# Altium schematic sheet SCH.SchDoc
size A1
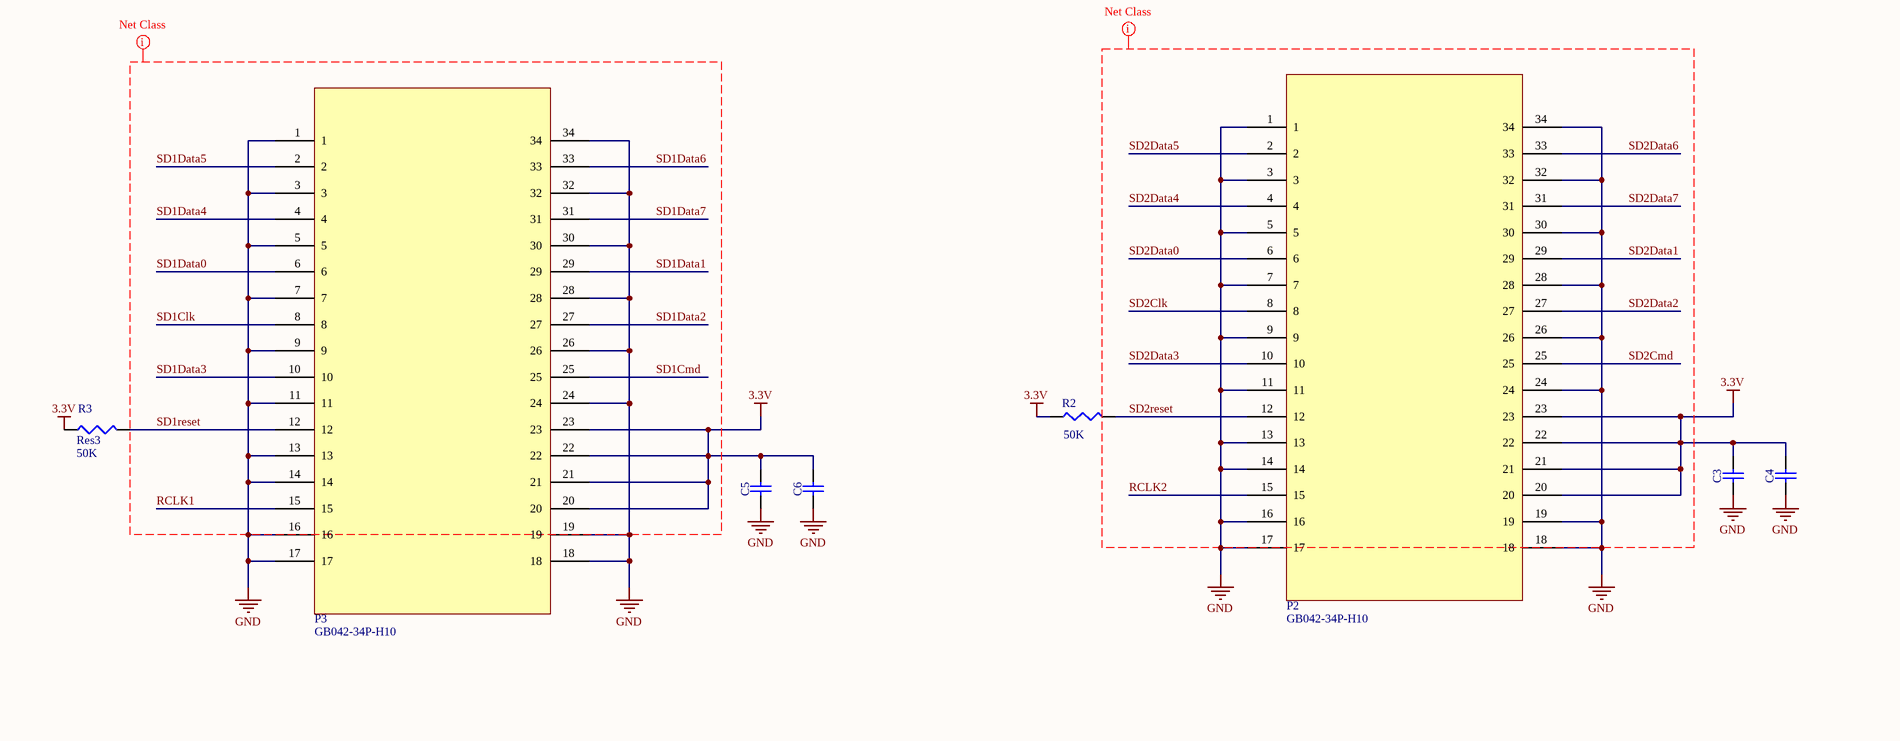
[diagram p0: SCH.SchDoc, top left]
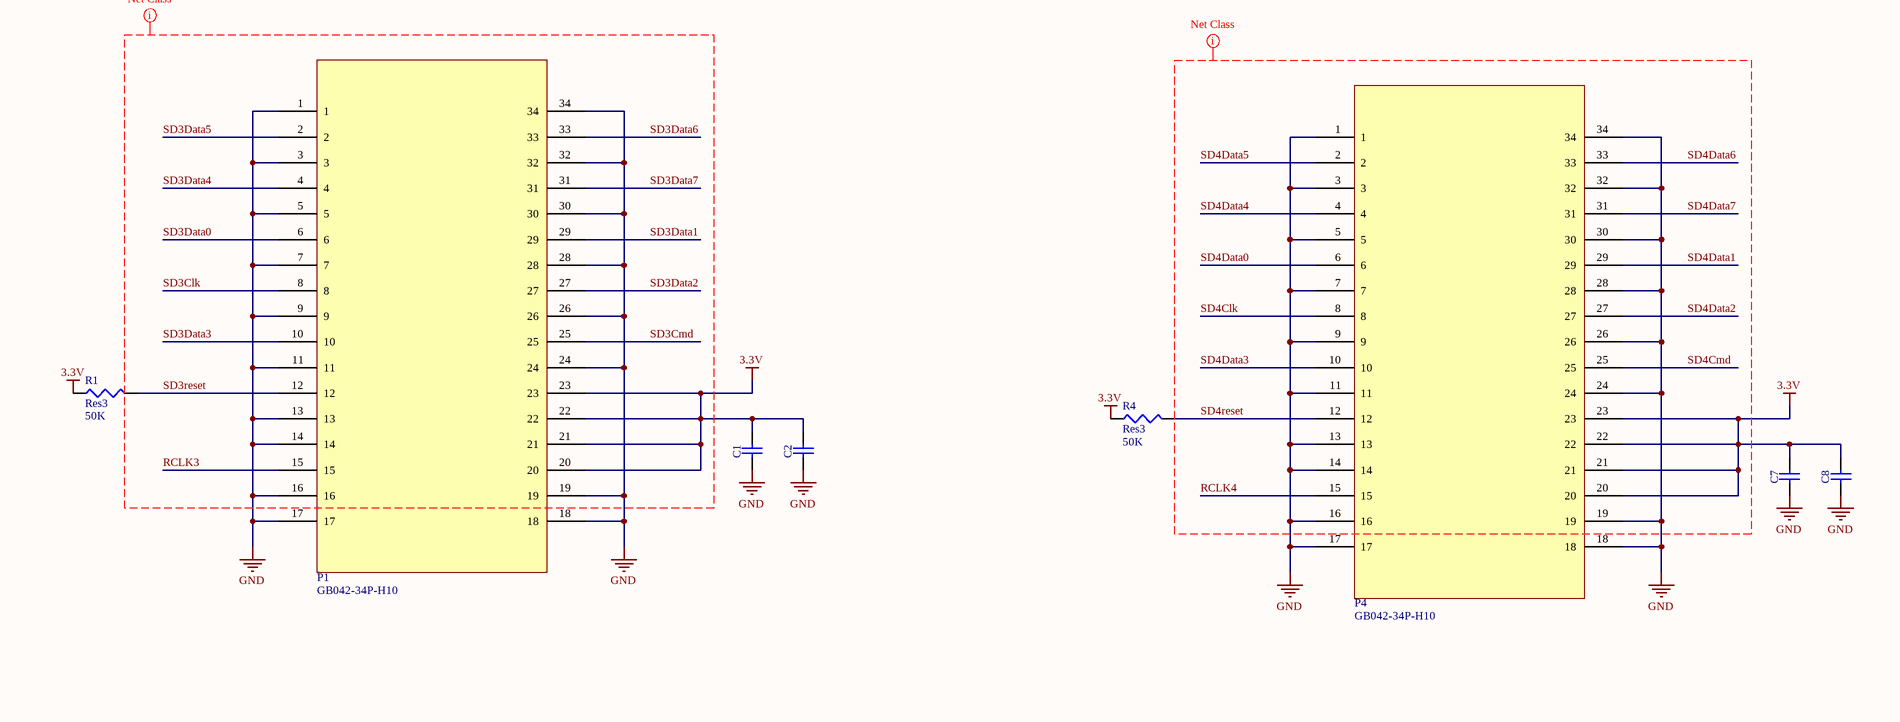
[diagram p1: SCH.SchDoc, top right]
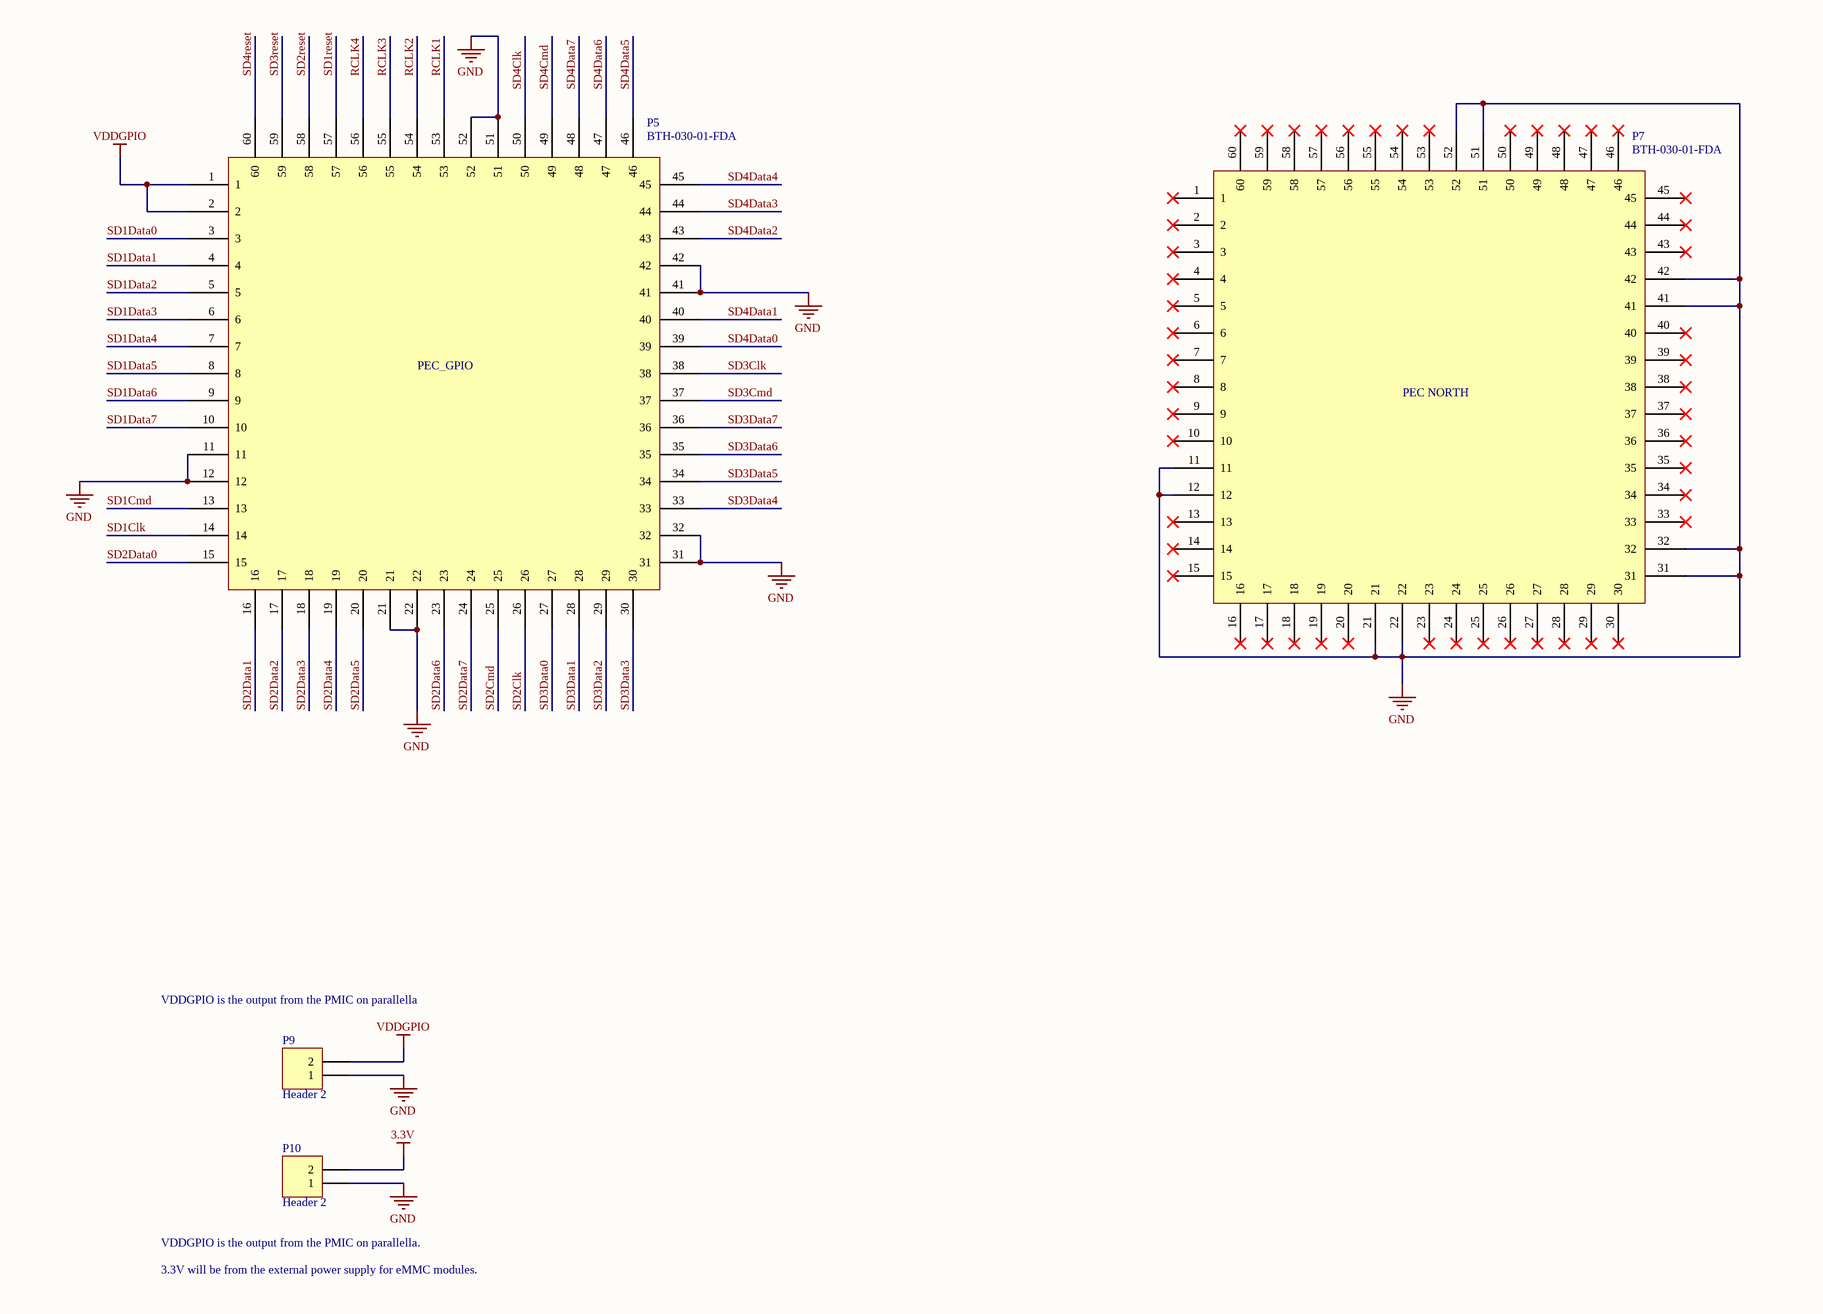
[diagram p2: SCH.SchDoc, bottom left]
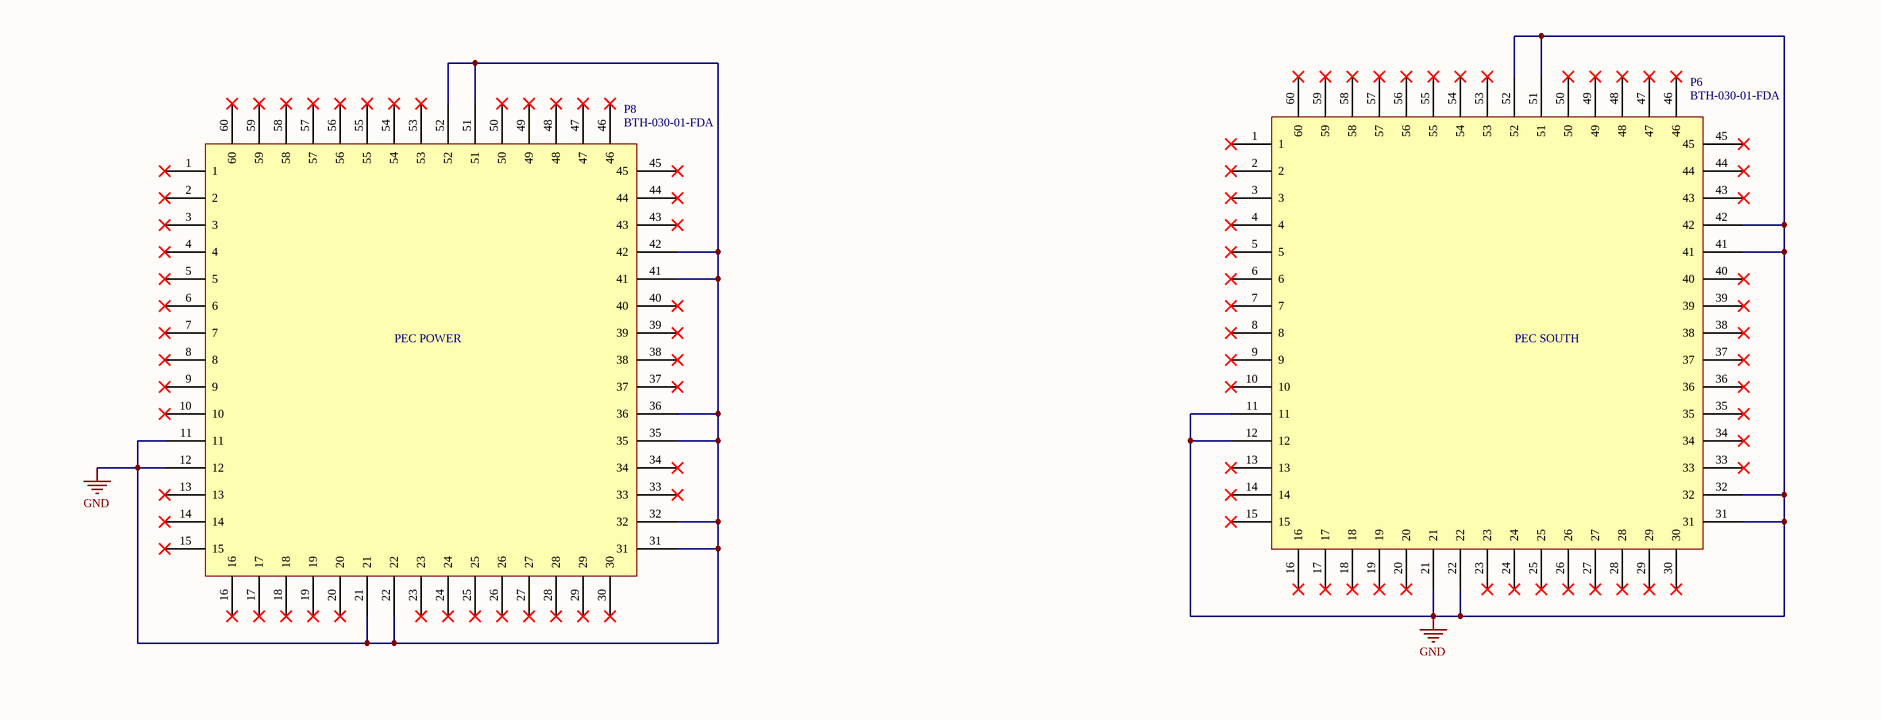
[diagram p3: SCH.SchDoc, bottom right]

## Parts
C1  4.7uF  [CAPC3216X140N]  (value not drawn)
C2  100nF  [CAPC1608X87N]  (value not drawn)
C3  4.7uF  [CAPC3216X140N]  (value not drawn)
C4  100nF  [CAPC1608X87N]  (value not drawn)
C5  4.7uF  [CAPC3216X140N]  (value not drawn)
C6  100nF  [CAPC1608X87N]  (value not drawn)
C7  4.7uF  [CAPC3216X140N]  (value not drawn)
C8  100nF  [CAPC1608X87N]  (value not drawn)
P1  GB042-34P-H10  [GB042-34P-H10]
P2  GB042-34P-H10  [GB042-34P-H10]
P3  GB042-34P-H10  [GB042-34P-H10]
P4  GB042-34P-H10  [GB042-34P-H10]
P5  BTH-030-01-FDA  [BTH-030-01-F-D-A]
P6  BTH-030-01-FDA  [BTH-030-01-F-D-A]
P7  BTH-030-01-FDA  [BTH-030-01-F-D-A]
P8  BTH-030-01-FDA  [BTH-030-01-F-D-A]
P9  Header 2  [HDR1X2]
P10  Header 2  [HDR1X2]
R1  Res3  value 50K  [J1-0603]
R2  value 50K  [J1-0603]  (hidden comment: Res3)
R3  Res3  value 50K  [J1-0603]
R4  Res3  value 50K  [J1-0603]

## Nets
3.3V: C1.2 C2.2 C3.2 C4.2 C5.2 C6.2 C7.2 C8.2 P1.20 P1.21 P1.22 P1.23 P2.20 P2.21 P2.22 P2.23 P3.20 P3.21 P3.22 P3.23 P4.20 P4.21 P4.22 P4.23 P10.2 R1.1 R2.1 R3.1 R4.1
GND: C1.1 C2.1 C3.1 C4.1 C5.1 C6.1 C7.1 C8.1 P1.1 P1.3 P1.5 P1.7 P1.9 P1.11 P1.13 P1.14 P1.16 P1.17 P1.18 P1.19 P1.24 P1.26 P1.28 P1.30 P1.32 P1.34 P2.1 P2.3 P2.5 P2.7 P2.9 P2.11 P2.13 P2.14 P2.16 P2.17 P2.18 P2.19 P2.24 P2.26 P2.28 P2.30 P2.32 P2.34 P3.1 P3.3 P3.5 P3.7 P3.9 P3.11 P3.13 P3.14 P3.16 P3.17 P3.18 P3.19 P3.24 P3.26 P3.28 P3.30 P3.32 P3.34 P4.1 P4.3 P4.5 P4.7 P4.9 P4.11 P4.13 P4.14 P4.16 P4.17 P4.18 P4.19 P4.24 P4.26 P4.28 P4.30 P4.32 P4.34 P5.11 P5.12 P5.21 P5.22 P5.31 P5.32 P5.41 P5.42 P5.51 P5.52 P6.11 P6.12 P6.21 P6.22 P6.31 P6.32 P6.41 P6.42 P6.51 P6.52 P7.11 P7.12 P7.21 P7.22 P7.31 P7.32 P7.41 P7.42 P7.51 P7.52 P8.11 P8.12 P8.21 P8.22 P8.31 P8.32 P8.35 P8.36 P8.41 P8.42 P8.51 P8.52 P9.1 P10.1
VDDGPIO: P5.1 P5.2 P9.2
RCLK1: P3.15 P5.53
RCLK2: P2.15 P5.54
RCLK3: P1.15 P5.55
RCLK4: P4.15 P5.56
SD1Clk: P3.8 P5.14
SD1Cmd: P3.25 P5.13
SD1Data0: P3.6 P5.3
SD1Data1: P3.29 P5.4
SD1Data2: P3.27 P5.5
SD1Data3: P3.10 P5.6
SD1Data4: P3.4 P5.7
SD1Data5: P3.2 P5.8
SD1Data6: P3.33 P5.9
SD1Data7: P3.31 P5.10
SD1reset: P3.12 P5.57 R3.2
SD2Clk: P2.8 P5.26
SD2Cmd: P2.25 P5.25
SD2Data0: P2.6 P5.15
SD2Data1: P2.29 P5.16
SD2Data2: P2.27 P5.17
SD2Data3: P2.10 P5.18
SD2Data4: P2.4 P5.19
SD2Data5: P2.2 P5.20
SD2Data6: P2.33 P5.23
SD2Data7: P2.31 P5.24
SD2reset: P2.12 P5.58 R2.2
SD3Clk: P1.8 P5.38
SD3Cmd: P1.25 P5.37
SD3Data0: P1.6 P5.27
SD3Data1: P1.29 P5.28
SD3Data2: P1.27 P5.29
SD3Data3: P1.10 P5.30
SD3Data4: P1.4 P5.33
SD3Data5: P1.2 P5.34
SD3Data6: P1.33 P5.35
SD3Data7: P1.31 P5.36
SD3reset: P1.12 P5.59 R1.2
SD4Clk: P4.8 P5.50
SD4Cmd: P4.25 P5.49
SD4Data0: P4.6 P5.39
SD4Data1: P4.29 P5.40
SD4Data2: P4.27 P5.43
SD4Data3: P4.10 P5.44
SD4Data4: P4.4 P5.45
SD4Data5: P4.2 P5.46
SD4Data6: P4.33 P5.47
SD4Data7: P4.31 P5.48
SD4reset: P4.12 P5.60 R4.2

Not connected (* = marked no-connect by the designer): P6 1* 2* 3* 4* 5* 6* 7* 8* 9* 10* 13* 14* 15* 16* 17* 18* 19* 20* 23* 24* 25* 26* 27* 28* 29* 30* 33* 34* 35* 36* 37* 38* 39* 40* 43* 44* 45* 46* 47* 48* 49* 50* 53* 54* 55* 56* 57* 58* 59* 60*; P7 1* 2* 3* 4* 5* 6* 7* 8* 9* 10* 13* 14* 15* 16* 17* 18* 19* 20* 23* 24* 25* 26* 27* 28* 29* 30* 33* 34* 35* 36* 37* 38* 39* 40* 43* 44* 45* 46* 47* 48* 49* 50* 53* 54* 55* 56* 57* 58* 59* 60*; P8 1* 2* 3* 4* 5* 6* 7* 8* 9* 10* 13* 14* 15* 16* 17* 18* 19* 20* 23* 24* 25* 26* 27* 28* 29* 30* 33* 34* 37* 38* 39* 40* 43* 44* 45* 46* 47* 48* 49* 50* 53* 54* 55* 56* 57* 58* 59* 60*

## Layout directives
net class SD1: RCLK1, SD1Clk, SD1Cmd, SD1Data0, SD1Data1, SD1Data2, SD1Data3, SD1Data4, SD1Data5, SD1Data6, SD1Data7, SD1reset
net class SD2: RCLK2, SD2Clk, SD2Cmd, SD2Data0, SD2Data1, SD2Data2, SD2Data3, SD2Data4, SD2Data5, SD2Data6, SD2Data7, SD2reset
net class SD3: RCLK3, SD3Clk, SD3Cmd, SD3Data0, SD3Data1, SD3Data2, SD3Data3, SD3Data4, SD3Data5, SD3Data6, SD3Data7, SD3reset
net class SD4: RCLK4, SD4Clk, SD4Cmd, SD4Data0, SD4Data1, SD4Data2, SD4Data3, SD4Data4, SD4Data5, SD4Data6, SD4Data7, SD4reset

## Notes on the sheet
- (near P5) PEC_GPIO
- (near P8) PEC POWER
- (near P6) PEC SOUTH
- (near P7) PEC NORTH
- VDDGPIO is the output from the PMIC on parallella
- VDDGPIO is the output from the PMIC on parallella.
- 3.3V will be from the external power supply for eMMC modules.
- Title
- Size:
- Date:
- File:
- A1
- Number:
- Time:
- Revision:
- Sheet
- of

## Library data of the parts
C1 C3 C5 C7 = CC1206_4.7UF_16V_10%_X5R: Non-polarised capacitor; Part Description: SMD Multilayer Chip Ceramic Capacitor; Manufacturer: GENERIC; Manufacturer1 Part Number: C1206C475K4PAC; Voltage: 16V; TC: X7R; Tolerance: ±10%; Table: Capacitors SMD; Part Number: CC1206_4.7UF_16V_10%_X5R; Component Kind: Standard; Component Type: Standard; Pin Count: 2; Value: 4.7uF; Status: Preferred; Manufacturer Part Number: CC1206_4.7UF_16V_10%_X5R; Case: 1206; Mounted: Yes; Socket: No; SMD: Yes; Manufacturer1 Example: KEMET; Manufacturer1 ComponentHeight: 1.8mm; HelpURL: \\cern.ch\dfs\Applications\Altium\Datasheets\CC1206_X5R_KEMET.pdf; Author: CERN DEM JLC; CreateDate: 3.12.2007; LatestRevisionDate: 3.12.2007
C2 C4 C6 C8 = CC0603_100NF_50V_10%_X7R: Non-polarised capacitor; Part Description: SMD Multilayer Chip Ceramic Capacitor; Manufacturer: GENERIC; Manufacturer1 Part Number: 223858615649; Voltage: 50V; TC: X7R; Tolerance: ±10%; Table: Capacitors SMD; Part Number: CC0603_100NF_50V_10%_X7R; Component Kind: Standard; Component Type: Standard; Pin Count: 2; Value: 100nF; Status: Preferred; Manufacturer Part Number: CC0603_100NF_50V_10%_X7R; Case: 0603; Mounted: Yes; Socket: No; SMD: Yes; Manufacturer1 Example: PHYCOMP; Manufacturer1 ComponentHeight: 0.87mm; HelpURL: \\cern.ch\dfs\Applications\Altium\Datasheets\CC0603_X7R_PHYCOMP.pdf; Author: CERN DEM JLC; CreateDate: 3.12.2007; LatestRevisionDate: 3.12.2007
P9 P10 = Header 2: Header, 2-Pin; LatestRevisionDate: 17-Jul-2002; LatestRevisionNote: Re-released for DXP Platform.; Publisher: Altium Limited
R1-R4 = Res3: Resistor; Published: 8-Jun-2000; LatestRevisionDate: 29-May-2009; LatestRevisionNote: IPC-7351 Footprint Added.; PackageReference: J1-0603; Publisher: Altium Limited; PackageDescription: Chip Resistor